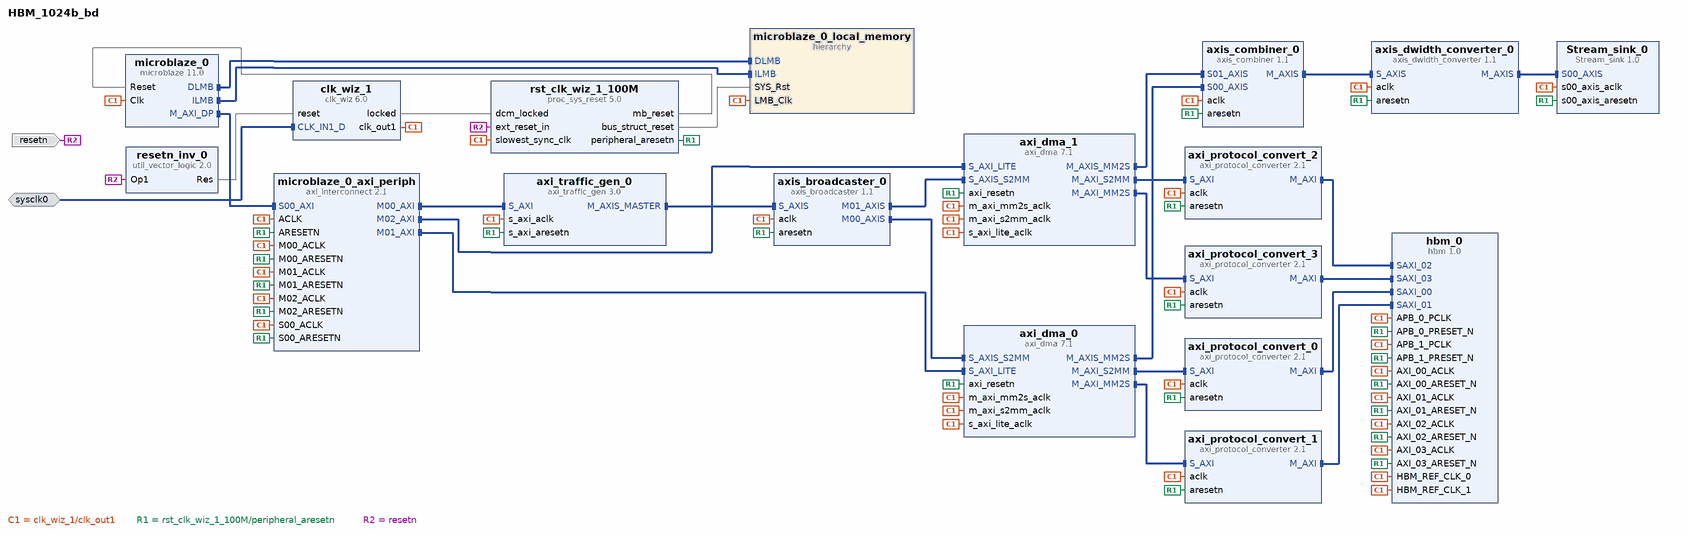
[diagram p0: block diagram of the top level]
# Vivado block design HBM_1024b_bd, xcu280-fsvh2892-2L-e, Vivado 2020.1
create_bd_design HBM_1024b_bd

create_bd_intf_port -mode Slave -vlnv xilinx.com:interface:diff_clock_rtl:1.0 sysclk0
set_property -dict {CONFIG.FREQ_HZ 100000000} [get_bd_intf_ports sysclk0]
create_bd_port -dir I -type rst resetn
set_property -dict {CONFIG.POLARITY ACTIVE_LOW} [get_bd_ports resetn]

create_bd_cell -type ip -vlnv xilinx.com:ip:hbm:1.0 hbm_0
set_property -dict [list \
  CONFIG.USER_APB_EN false \
  CONFIG.USER_CLK_SEL_LIST0 AXI_01_ACLK \
  CONFIG.USER_CLK_SEL_LIST1 AXI_16_ACLK \
  CONFIG.USER_HBM_CP_1 6 \
  CONFIG.USER_HBM_DENSITY 8GB \
  CONFIG.USER_HBM_FBDIV_1 36 \
  CONFIG.USER_HBM_HEX_CP_RES_1 0x0000A600 \
  CONFIG.USER_HBM_HEX_FBDIV_CLKOUTDIV_1 0x00000902 \
  CONFIG.USER_HBM_HEX_LOCK_FB_REF_DLY_1 0x00001f1f \
  CONFIG.USER_HBM_LOCK_FB_DLY_1 31 \
  CONFIG.USER_HBM_LOCK_REF_DLY_1 31 \
  CONFIG.USER_HBM_RES_1 10 \
  CONFIG.USER_HBM_STACK 2 \
  CONFIG.USER_MC_ENABLE_08 TRUE \
  CONFIG.USER_MC_ENABLE_09 TRUE \
  CONFIG.USER_MC_ENABLE_10 TRUE \
  CONFIG.USER_MC_ENABLE_11 TRUE \
  CONFIG.USER_MC_ENABLE_12 TRUE \
  CONFIG.USER_MC_ENABLE_13 TRUE \
  CONFIG.USER_MC_ENABLE_14 TRUE \
  CONFIG.USER_MC_ENABLE_15 TRUE \
  CONFIG.USER_MC_ENABLE_APB_01 TRUE \
  CONFIG.USER_PHY_ENABLE_08 TRUE \
  CONFIG.USER_PHY_ENABLE_09 TRUE \
  CONFIG.USER_PHY_ENABLE_10 TRUE \
  CONFIG.USER_PHY_ENABLE_11 TRUE \
  CONFIG.USER_PHY_ENABLE_12 TRUE \
  CONFIG.USER_PHY_ENABLE_13 TRUE \
  CONFIG.USER_PHY_ENABLE_14 TRUE \
  CONFIG.USER_PHY_ENABLE_15 TRUE \
  CONFIG.USER_SAXI_00 true \
  CONFIG.USER_SAXI_01 true \
  CONFIG.USER_SAXI_02 true \
  CONFIG.USER_SAXI_03 true \
  CONFIG.USER_SAXI_04 false \
  CONFIG.USER_SAXI_05 false \
  CONFIG.USER_SAXI_06 false \
  CONFIG.USER_SAXI_07 false \
  CONFIG.USER_SAXI_08 false \
  CONFIG.USER_SAXI_09 false \
  CONFIG.USER_SAXI_10 false \
  CONFIG.USER_SAXI_11 false \
  CONFIG.USER_SAXI_12 false \
  CONFIG.USER_SAXI_13 false \
  CONFIG.USER_SAXI_14 false \
  CONFIG.USER_SAXI_15 false \
  CONFIG.USER_SAXI_16 false \
  CONFIG.USER_SAXI_17 false \
  CONFIG.USER_SAXI_18 false \
  CONFIG.USER_SAXI_19 false \
  CONFIG.USER_SAXI_20 false \
  CONFIG.USER_SAXI_21 false \
  CONFIG.USER_SAXI_22 false \
  CONFIG.USER_SAXI_23 false \
  CONFIG.USER_SAXI_24 false \
  CONFIG.USER_SAXI_25 false \
  CONFIG.USER_SAXI_26 false \
  CONFIG.USER_SAXI_27 false \
  CONFIG.USER_SAXI_28 false \
  CONFIG.USER_SAXI_29 false \
  CONFIG.USER_SAXI_30 false \
  CONFIG.USER_SAXI_31 false \
  CONFIG.USER_SWITCH_ENABLE_00 TRUE \
  CONFIG.USER_SWITCH_ENABLE_01 TRUE \
] [get_bd_cells hbm_0]
create_bd_cell -type ip -vlnv xilinx.com:ip:microblaze:11.0 microblaze_0
set_property -dict [list \
  CONFIG.C_ADDR_TAG_BITS 0 \
  CONFIG.C_DATA_SIZE 64 \
  CONFIG.C_DCACHE_ADDR_TAG 0 \
  CONFIG.C_DEBUG_ENABLED 0 \
  CONFIG.C_D_AXI 1 \
  CONFIG.C_D_LMB 1 \
  CONFIG.C_I_LMB 1 \
  CONFIG.C_TRACE 1 \
] [get_bd_cells microblaze_0]
create_bd_cell -type ip -vlnv xilinx.com:ip:axi_traffic_gen:3.0 axi_traffic_gen_0
set_property -dict [list \
  CONFIG.C_ATG_MODE AXI4-Stream \
  CONFIG.C_AXIS_TDATA_WIDTH 512 \
  CONFIG.C_AXIS_TDEST_WIDTH 0 \
  CONFIG.C_AXIS_TID_WIDTH 0 \
  CONFIG.C_AXIS_TUSER_WIDTH 0 \
] [get_bd_cells axi_traffic_gen_0]
create_bd_cell -type ip -vlnv xilinx.com:ip:axi_dma:7.1 axi_dma_0
set_property -dict [list \
  CONFIG.c_addr_width 33 \
  CONFIG.c_include_mm2s 1 \
  CONFIG.c_include_sg 0 \
  CONFIG.c_m_axi_mm2s_data_width 256 \
  CONFIG.c_m_axis_mm2s_tdata_width 32 \
  CONFIG.c_mm2s_burst_size 16 \
  CONFIG.c_sg_length_width 23 \
] [get_bd_cells axi_dma_0]
create_bd_cell -type ip -vlnv xilinx.com:ip:axis_broadcaster:1.1 axis_broadcaster_0
set_property -dict [list \
  CONFIG.M00_TDATA_REMAP {tdata[255:0]} \
  CONFIG.M01_TDATA_REMAP {tdata[255:0]} \
  CONFIG.M02_TDATA_REMAP {tdata[255:0]} \
  CONFIG.M03_TDATA_REMAP {tdata[255:0]} \
  CONFIG.M_TDATA_NUM_BYTES 32 \
  CONFIG.NUM_MI 2 \
  CONFIG.S_TDATA_NUM_BYTES 64 \
] [get_bd_cells axis_broadcaster_0]
create_bd_cell -type ip -vlnv xilinx.com:ip:axi_dma:7.1 axi_dma_1
set_property -dict [list \
  CONFIG.c_addr_width 33 \
  CONFIG.c_include_mm2s 1 \
  CONFIG.c_include_sg 0 \
  CONFIG.c_m_axi_mm2s_data_width 256 \
  CONFIG.c_m_axis_mm2s_tdata_width 32 \
  CONFIG.c_mm2s_burst_size 16 \
  CONFIG.c_sg_length_width 23 \
] [get_bd_cells axi_dma_1]
create_bd_cell -type hier microblaze_0_local_memory
create_bd_cell -type ip -vlnv xilinx.com:ip:clk_wiz:6.0 clk_wiz_1
set_property -dict [list \
  CONFIG.CLK_IN1_BOARD_INTERFACE sysclk0 \
  CONFIG.PRIM_SOURCE Differential_clock_capable_pin \
  CONFIG.RESET_BOARD_INTERFACE resetn \
  CONFIG.USE_BOARD_FLOW true \
] [get_bd_cells clk_wiz_1]
create_bd_cell -type ip -vlnv xilinx.com:ip:proc_sys_reset:5.0 rst_clk_wiz_1_100M
set_property -dict {CONFIG.RESET_BOARD_INTERFACE resetn CONFIG.USE_BOARD_FLOW true} [get_bd_cells rst_clk_wiz_1_100M]
create_bd_cell -type ip -vlnv xilinx.com:ip:axi_protocol_converter:2.1 axi_protocol_convert_0
set_property -dict {CONFIG.TRANSLATION_MODE 2} [get_bd_cells axi_protocol_convert_0]
create_bd_cell -type ip -vlnv xilinx.com:ip:axi_protocol_converter:2.1 axi_protocol_convert_1
set_property -dict {CONFIG.TRANSLATION_MODE 2} [get_bd_cells axi_protocol_convert_1]
create_bd_cell -type ip -vlnv xilinx.com:ip:axi_protocol_converter:2.1 axi_protocol_convert_2
set_property -dict {CONFIG.TRANSLATION_MODE 2} [get_bd_cells axi_protocol_convert_2]
create_bd_cell -type ip -vlnv xilinx.com:ip:axi_protocol_converter:2.1 axi_protocol_convert_3
set_property -dict {CONFIG.TRANSLATION_MODE 2} [get_bd_cells axi_protocol_convert_3]
create_bd_cell -type ip -vlnv xilinx.com:ip:axi_interconnect:2.1 microblaze_0_axi_periph
set_property -dict {CONFIG.NUM_MI 3} [get_bd_cells microblaze_0_axi_periph]
create_bd_cell -type ip -vlnv xilinx.com:ip:util_vector_logic:2.0 resetn_inv_0
set_property -dict {CONFIG.C_OPERATION not CONFIG.C_SIZE 1} [get_bd_cells resetn_inv_0]
create_bd_cell -type ip -vlnv xilinx.com:ip:axis_combiner:1.1 axis_combiner_0
create_bd_cell -type ip -vlnv user.org:user:Stream_sink:1.0 Stream_sink_0
create_bd_cell -type ip -vlnv xilinx.com:ip:axis_dwidth_converter:1.1 axis_dwidth_converter_0
set_property -dict {CONFIG.M_TDATA_NUM_BYTES 32} [get_bd_cells axis_dwidth_converter_0]

# ---- hierarchy /microblaze_0_local_memory ----
current_bd_instance /microblaze_0_local_memory
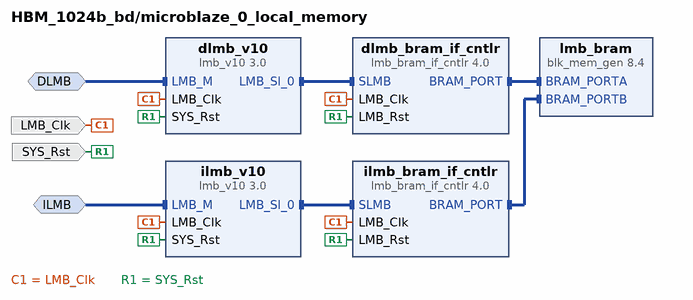
[diagram p1: block diagram inside /microblaze_0_local_memory]
create_bd_intf_pin -mode MirroredMaster -vlnv xilinx.com:interface:lmb_rtl:1.0 DLMB
create_bd_intf_pin -mode MirroredMaster -vlnv xilinx.com:interface:lmb_rtl:1.0 ILMB
create_bd_pin -dir I -type clk LMB_Clk
create_bd_pin -dir I -type rst SYS_Rst

create_bd_cell -type ip -vlnv xilinx.com:ip:lmb_v10:3.0 dlmb_v10
create_bd_cell -type ip -vlnv xilinx.com:ip:lmb_v10:3.0 ilmb_v10
create_bd_cell -type ip -vlnv xilinx.com:ip:lmb_bram_if_cntlr:4.0 dlmb_bram_if_cntlr
set_property -dict {CONFIG.C_ECC 0} [get_bd_cells dlmb_bram_if_cntlr]
create_bd_cell -type ip -vlnv xilinx.com:ip:lmb_bram_if_cntlr:4.0 ilmb_bram_if_cntlr
set_property -dict {CONFIG.C_ECC 0} [get_bd_cells ilmb_bram_if_cntlr]
create_bd_cell -type ip -vlnv xilinx.com:ip:blk_mem_gen:8.4 lmb_bram
set_property -dict {CONFIG.Memory_Type True_Dual_Port_RAM CONFIG.use_bram_block BRAM_Controller} [get_bd_cells lmb_bram]

# ---- connections ----

current_bd_instance /microblaze_0_local_memory
connect_bd_intf_net -intf_net microblaze_0_dlmb_bus [get_bd_intf_pins dlmb_v10/LMB_Sl_0] [get_bd_intf_pins dlmb_bram_if_cntlr/SLMB]
connect_bd_intf_net -intf_net microblaze_0_ilmb_bus [get_bd_intf_pins ilmb_v10/LMB_Sl_0] [get_bd_intf_pins ilmb_bram_if_cntlr/SLMB]
connect_bd_intf_net -intf_net microblaze_0_dlmb_cntlr [get_bd_intf_pins dlmb_bram_if_cntlr/BRAM_PORT] [get_bd_intf_pins lmb_bram/BRAM_PORTA]
connect_bd_intf_net -intf_net microblaze_0_ilmb_cntlr [get_bd_intf_pins ilmb_bram_if_cntlr/BRAM_PORT] [get_bd_intf_pins lmb_bram/BRAM_PORTB]
connect_bd_intf_net -intf_net microblaze_0_dlmb [get_bd_intf_pins DLMB] [get_bd_intf_pins dlmb_v10/LMB_M]
connect_bd_intf_net -intf_net microblaze_0_ilmb [get_bd_intf_pins ILMB] [get_bd_intf_pins ilmb_v10/LMB_M]
connect_bd_net -net microblaze_0_Clk [get_bd_pins LMB_Clk] \
  [get_bd_pins dlmb_v10/LMB_Clk] [get_bd_pins dlmb_bram_if_cntlr/LMB_Clk] [get_bd_pins ilmb_v10/LMB_Clk] \
  [get_bd_pins ilmb_bram_if_cntlr/LMB_Clk]
connect_bd_net [get_bd_pins SYS_Rst] \
  [get_bd_pins dlmb_v10/SYS_Rst] [get_bd_pins dlmb_bram_if_cntlr/LMB_Rst] [get_bd_pins ilmb_v10/SYS_Rst] \
  [get_bd_pins ilmb_bram_if_cntlr/LMB_Rst]
set_property HDL_ATTRIBUTE.BMM_INFO_ADDRESS_SPACE {byte  0x00000000 32 > HBM_1024b_bd microblaze_0_local_memory/lmb_bram} [get_bd_cells dlmb_bram_if_cntlr]
set_property HDL_ATTRIBUTE.KEEP_HIERARCHY yes [get_bd_cells dlmb_bram_if_cntlr]
set_property HDL_ATTRIBUTE.BMM_INFO_ADDRESS_SPACE {byte  0x00000000 32 > HBM_1024b_bd microblaze_0_local_memory/lmb_bram} [get_bd_cells ilmb_bram_if_cntlr]
set_property HDL_ATTRIBUTE.KEEP_HIERARCHY yes [get_bd_cells ilmb_bram_if_cntlr]

current_bd_instance /
connect_bd_intf_net [get_bd_intf_pins microblaze_0/M_AXI_DP] [get_bd_intf_pins microblaze_0_axi_periph/S00_AXI]
connect_bd_intf_net [get_bd_intf_pins microblaze_0/DLMB] [get_bd_intf_pins microblaze_0_local_memory/DLMB]
connect_bd_intf_net [get_bd_intf_pins axis_broadcaster_0/M00_AXIS] [get_bd_intf_pins axi_dma_0/S_AXIS_S2MM]
connect_bd_intf_net [get_bd_intf_pins axi_traffic_gen_0/M_AXIS_MASTER] [get_bd_intf_pins axis_broadcaster_0/S_AXIS]
connect_bd_intf_net [get_bd_intf_pins axis_dwidth_converter_0/M_AXIS] [get_bd_intf_pins Stream_sink_0/S00_AXIS]
connect_bd_intf_net [get_bd_intf_pins axis_broadcaster_0/M01_AXIS] [get_bd_intf_pins axi_dma_1/S_AXIS_S2MM]
connect_bd_intf_net [get_bd_intf_pins microblaze_0/ILMB] [get_bd_intf_pins microblaze_0_local_memory/ILMB]
connect_bd_intf_net [get_bd_intf_pins axi_dma_0/M_AXI_MM2S] [get_bd_intf_pins axi_protocol_convert_1/S_AXI]
connect_bd_intf_net [get_bd_intf_pins axi_dma_0/M_AXI_S2MM] [get_bd_intf_pins axi_protocol_convert_0/S_AXI]
connect_bd_intf_net [get_bd_intf_pins axis_combiner_0/M_AXIS] [get_bd_intf_pins axis_dwidth_converter_0/S_AXIS]
connect_bd_intf_net -intf_net sysclk0_1 [get_bd_intf_ports sysclk0] [get_bd_intf_pins clk_wiz_1/CLK_IN1_D]
connect_bd_intf_net [get_bd_intf_pins axi_protocol_convert_2/M_AXI] [get_bd_intf_pins hbm_0/SAXI_02]
connect_bd_intf_net [get_bd_intf_pins microblaze_0_axi_periph/M01_AXI] [get_bd_intf_pins axi_dma_0/S_AXI_LITE]
connect_bd_intf_net [get_bd_intf_pins microblaze_0_axi_periph/M00_AXI] [get_bd_intf_pins axi_traffic_gen_0/S_AXI]
connect_bd_intf_net [get_bd_intf_pins microblaze_0_axi_periph/M02_AXI] [get_bd_intf_pins axi_dma_1/S_AXI_LITE]
connect_bd_intf_net [get_bd_intf_pins axi_protocol_convert_0/M_AXI] [get_bd_intf_pins hbm_0/SAXI_00]
connect_bd_intf_net [get_bd_intf_pins axi_protocol_convert_3/M_AXI] [get_bd_intf_pins hbm_0/SAXI_03]
connect_bd_intf_net [get_bd_intf_pins axi_dma_1/M_AXIS_MM2S] [get_bd_intf_pins axis_combiner_0/S01_AXIS]
connect_bd_intf_net [get_bd_intf_pins axi_dma_1/M_AXI_MM2S] [get_bd_intf_pins axi_protocol_convert_3/S_AXI]
connect_bd_intf_net [get_bd_intf_pins axi_dma_0/M_AXIS_MM2S] [get_bd_intf_pins axis_combiner_0/S00_AXIS]
connect_bd_intf_net [get_bd_intf_pins axi_dma_1/M_AXI_S2MM] [get_bd_intf_pins axi_protocol_convert_2/S_AXI]
connect_bd_intf_net [get_bd_intf_pins axi_protocol_convert_1/M_AXI] [get_bd_intf_pins hbm_0/SAXI_01]
connect_bd_net -net microblaze_0_Clk [get_bd_pins clk_wiz_1/clk_out1] \
  [get_bd_pins microblaze_0/Clk] [get_bd_pins microblaze_0_local_memory/LMB_Clk] \
  [get_bd_pins rst_clk_wiz_1_100M/slowest_sync_clk] [get_bd_pins axi_dma_0/m_axi_s2mm_aclk] \
  [get_bd_pins axi_protocol_convert_0/aclk] [get_bd_pins axis_broadcaster_0/aclk] \
  [get_bd_pins microblaze_0_axi_periph/S00_ACLK] [get_bd_pins axi_dma_0/s_axi_lite_aclk] \
  [get_bd_pins microblaze_0_axi_periph/M00_ACLK] [get_bd_pins microblaze_0_axi_periph/ACLK] \
  [get_bd_pins axi_dma_1/m_axi_s2mm_aclk] [get_bd_pins axi_protocol_convert_1/aclk] [get_bd_pins axi_dma_1/s_axi_lite_aclk] \
  [get_bd_pins microblaze_0_axi_periph/M01_ACLK] [get_bd_pins axi_protocol_convert_2/aclk] \
  [get_bd_pins microblaze_0_axi_periph/M02_ACLK] [get_bd_pins axi_protocol_convert_3/aclk] \
  [get_bd_pins axi_traffic_gen_0/s_axi_aclk] [get_bd_pins hbm_0/HBM_REF_CLK_0] [get_bd_pins hbm_0/APB_0_PCLK] \
  [get_bd_pins hbm_0/HBM_REF_CLK_1] [get_bd_pins hbm_0/APB_1_PCLK] [get_bd_pins hbm_0/AXI_00_ACLK] \
  [get_bd_pins axi_dma_0/m_axi_mm2s_aclk] [get_bd_pins axis_combiner_0/aclk] [get_bd_pins axi_dma_1/m_axi_mm2s_aclk] \
  [get_bd_pins Stream_sink_0/s00_axis_aclk] [get_bd_pins hbm_0/AXI_01_ACLK] [get_bd_pins hbm_0/AXI_02_ACLK] \
  [get_bd_pins hbm_0/AXI_03_ACLK] [get_bd_pins axis_dwidth_converter_0/aclk]
connect_bd_net [get_bd_pins clk_wiz_1/locked] [get_bd_pins rst_clk_wiz_1_100M/dcm_locked]
connect_bd_net [get_bd_pins rst_clk_wiz_1_100M/mb_reset] [get_bd_pins microblaze_0/Reset]
connect_bd_net [get_bd_pins rst_clk_wiz_1_100M/bus_struct_reset] [get_bd_pins microblaze_0_local_memory/SYS_Rst]
connect_bd_net [get_bd_pins rst_clk_wiz_1_100M/peripheral_aresetn] \
  [get_bd_pins axi_protocol_convert_0/aresetn] [get_bd_pins axis_broadcaster_0/aresetn] \
  [get_bd_pins microblaze_0_axi_periph/S00_ARESETN] [get_bd_pins axi_dma_0/axi_resetn] \
  [get_bd_pins microblaze_0_axi_periph/M00_ARESETN] [get_bd_pins microblaze_0_axi_periph/ARESETN] \
  [get_bd_pins axi_protocol_convert_1/aresetn] [get_bd_pins axi_dma_1/axi_resetn] \
  [get_bd_pins microblaze_0_axi_periph/M01_ARESETN] [get_bd_pins axi_protocol_convert_2/aresetn] \
  [get_bd_pins microblaze_0_axi_periph/M02_ARESETN] [get_bd_pins axi_protocol_convert_3/aresetn] \
  [get_bd_pins axi_traffic_gen_0/s_axi_aresetn] [get_bd_pins hbm_0/APB_1_PRESET_N] [get_bd_pins hbm_0/APB_0_PRESET_N] \
  [get_bd_pins hbm_0/AXI_00_ARESET_N] [get_bd_pins axis_combiner_0/aresetn] [get_bd_pins Stream_sink_0/s00_axis_aresetn] \
  [get_bd_pins hbm_0/AXI_01_ARESET_N] [get_bd_pins hbm_0/AXI_02_ARESET_N] [get_bd_pins hbm_0/AXI_03_ARESET_N] \
  [get_bd_pins axis_dwidth_converter_0/aresetn]
connect_bd_net [get_bd_ports resetn] [get_bd_pins resetn_inv_0/Op1] [get_bd_pins rst_clk_wiz_1_100M/ext_reset_in]
connect_bd_net [get_bd_pins resetn_inv_0/Res] [get_bd_pins clk_wiz_1/reset]
set_property HDL_ATTRIBUTE.BMM_INFO_PROCESSOR {microblaze-le > HBM_1024b_bd microblaze_0_local_memory/dlmb_bram_if_cntlr} [get_bd_cells microblaze_0]
set_property HDL_ATTRIBUTE.KEEP_HIERARCHY yes [get_bd_cells microblaze_0]

# ---- address map ----
assign_bd_address -offset 0x008000000 -range 128M -target_address_space [get_bd_addr_spaces axi_dma_0/Data_MM2S] [get_bd_addr_segs hbm_0/SAXI_01/HBM_MEM00]
assign_bd_address -offset 0x010000000 -range 256M -target_address_space [get_bd_addr_spaces axi_dma_0/Data_MM2S] [get_bd_addr_segs hbm_0/SAXI_01/HBM_MEM01]
assign_bd_address -offset 0x020000000 -range 256M -target_address_space [get_bd_addr_spaces axi_dma_0/Data_MM2S] [get_bd_addr_segs hbm_0/SAXI_01/HBM_MEM02]
assign_bd_address -offset 0x030000000 -range 256M -target_address_space [get_bd_addr_spaces axi_dma_0/Data_MM2S] [get_bd_addr_segs hbm_0/SAXI_01/HBM_MEM03]
assign_bd_address -offset 0x040000000 -range 256M -target_address_space [get_bd_addr_spaces axi_dma_0/Data_MM2S] [get_bd_addr_segs hbm_0/SAXI_01/HBM_MEM04]
assign_bd_address -offset 0x050000000 -range 256M -target_address_space [get_bd_addr_spaces axi_dma_0/Data_MM2S] [get_bd_addr_segs hbm_0/SAXI_01/HBM_MEM05]
assign_bd_address -offset 0x060000000 -range 256M -target_address_space [get_bd_addr_spaces axi_dma_0/Data_MM2S] [get_bd_addr_segs hbm_0/SAXI_01/HBM_MEM06]
assign_bd_address -offset 0x070000000 -range 256M -target_address_space [get_bd_addr_spaces axi_dma_0/Data_MM2S] [get_bd_addr_segs hbm_0/SAXI_01/HBM_MEM07]
assign_bd_address -offset 0x080000000 -range 256M -target_address_space [get_bd_addr_spaces axi_dma_0/Data_MM2S] [get_bd_addr_segs hbm_0/SAXI_01/HBM_MEM08]
assign_bd_address -offset 0x090000000 -range 256M -target_address_space [get_bd_addr_spaces axi_dma_0/Data_MM2S] [get_bd_addr_segs hbm_0/SAXI_01/HBM_MEM09]
assign_bd_address -offset 0x0A0000000 -range 256M -target_address_space [get_bd_addr_spaces axi_dma_0/Data_MM2S] [get_bd_addr_segs hbm_0/SAXI_01/HBM_MEM10]
assign_bd_address -offset 0x0B0000000 -range 256M -target_address_space [get_bd_addr_spaces axi_dma_0/Data_MM2S] [get_bd_addr_segs hbm_0/SAXI_01/HBM_MEM11]
assign_bd_address -offset 0x0C0000000 -range 256M -target_address_space [get_bd_addr_spaces axi_dma_0/Data_MM2S] [get_bd_addr_segs hbm_0/SAXI_01/HBM_MEM12]
assign_bd_address -offset 0x0D0000000 -range 256M -target_address_space [get_bd_addr_spaces axi_dma_0/Data_MM2S] [get_bd_addr_segs hbm_0/SAXI_01/HBM_MEM13]
assign_bd_address -offset 0x0E0000000 -range 256M -target_address_space [get_bd_addr_spaces axi_dma_0/Data_MM2S] [get_bd_addr_segs hbm_0/SAXI_01/HBM_MEM14]
assign_bd_address -offset 0x0F0000000 -range 256M -target_address_space [get_bd_addr_spaces axi_dma_0/Data_MM2S] [get_bd_addr_segs hbm_0/SAXI_01/HBM_MEM15]
assign_bd_address -offset 0x100000000 -range 256M -target_address_space [get_bd_addr_spaces axi_dma_0/Data_MM2S] [get_bd_addr_segs hbm_0/SAXI_01/HBM_MEM16]
assign_bd_address -offset 0x110000000 -range 256M -target_address_space [get_bd_addr_spaces axi_dma_0/Data_MM2S] [get_bd_addr_segs hbm_0/SAXI_01/HBM_MEM17]
assign_bd_address -offset 0x120000000 -range 256M -target_address_space [get_bd_addr_spaces axi_dma_0/Data_MM2S] [get_bd_addr_segs hbm_0/SAXI_01/HBM_MEM18]
assign_bd_address -offset 0x130000000 -range 256M -target_address_space [get_bd_addr_spaces axi_dma_0/Data_MM2S] [get_bd_addr_segs hbm_0/SAXI_01/HBM_MEM19]
assign_bd_address -offset 0x140000000 -range 256M -target_address_space [get_bd_addr_spaces axi_dma_0/Data_MM2S] [get_bd_addr_segs hbm_0/SAXI_01/HBM_MEM20]
assign_bd_address -offset 0x150000000 -range 256M -target_address_space [get_bd_addr_spaces axi_dma_0/Data_MM2S] [get_bd_addr_segs hbm_0/SAXI_01/HBM_MEM21]
assign_bd_address -offset 0x160000000 -range 256M -target_address_space [get_bd_addr_spaces axi_dma_0/Data_MM2S] [get_bd_addr_segs hbm_0/SAXI_01/HBM_MEM22]
assign_bd_address -offset 0x170000000 -range 256M -target_address_space [get_bd_addr_spaces axi_dma_0/Data_MM2S] [get_bd_addr_segs hbm_0/SAXI_01/HBM_MEM23]
assign_bd_address -offset 0x180000000 -range 256M -target_address_space [get_bd_addr_spaces axi_dma_0/Data_MM2S] [get_bd_addr_segs hbm_0/SAXI_01/HBM_MEM24]
assign_bd_address -offset 0x190000000 -range 256M -target_address_space [get_bd_addr_spaces axi_dma_0/Data_MM2S] [get_bd_addr_segs hbm_0/SAXI_01/HBM_MEM25]
assign_bd_address -offset 0x1A0000000 -range 256M -target_address_space [get_bd_addr_spaces axi_dma_0/Data_MM2S] [get_bd_addr_segs hbm_0/SAXI_01/HBM_MEM26]
assign_bd_address -offset 0x1B0000000 -range 256M -target_address_space [get_bd_addr_spaces axi_dma_0/Data_MM2S] [get_bd_addr_segs hbm_0/SAXI_01/HBM_MEM27]
assign_bd_address -offset 0x1C0000000 -range 256M -target_address_space [get_bd_addr_spaces axi_dma_0/Data_MM2S] [get_bd_addr_segs hbm_0/SAXI_01/HBM_MEM28]
assign_bd_address -offset 0x1D0000000 -range 256M -target_address_space [get_bd_addr_spaces axi_dma_0/Data_MM2S] [get_bd_addr_segs hbm_0/SAXI_01/HBM_MEM29]
assign_bd_address -offset 0x1E0000000 -range 256M -target_address_space [get_bd_addr_spaces axi_dma_0/Data_MM2S] [get_bd_addr_segs hbm_0/SAXI_01/HBM_MEM30]
assign_bd_address -offset 0x1F0000000 -range 256M -target_address_space [get_bd_addr_spaces axi_dma_0/Data_MM2S] [get_bd_addr_segs hbm_0/SAXI_01/HBM_MEM31]
assign_bd_address -offset 0x008000000 -range 128M -target_address_space [get_bd_addr_spaces axi_dma_0/Data_S2MM] [get_bd_addr_segs hbm_0/SAXI_00/HBM_MEM00]
assign_bd_address -offset 0x010000000 -range 256M -target_address_space [get_bd_addr_spaces axi_dma_0/Data_S2MM] [get_bd_addr_segs hbm_0/SAXI_00/HBM_MEM01]
assign_bd_address -offset 0x020000000 -range 256M -target_address_space [get_bd_addr_spaces axi_dma_0/Data_S2MM] [get_bd_addr_segs hbm_0/SAXI_00/HBM_MEM02]
assign_bd_address -offset 0x030000000 -range 256M -target_address_space [get_bd_addr_spaces axi_dma_0/Data_S2MM] [get_bd_addr_segs hbm_0/SAXI_00/HBM_MEM03]
assign_bd_address -offset 0x040000000 -range 256M -target_address_space [get_bd_addr_spaces axi_dma_0/Data_S2MM] [get_bd_addr_segs hbm_0/SAXI_00/HBM_MEM04]
assign_bd_address -offset 0x050000000 -range 256M -target_address_space [get_bd_addr_spaces axi_dma_0/Data_S2MM] [get_bd_addr_segs hbm_0/SAXI_00/HBM_MEM05]
assign_bd_address -offset 0x060000000 -range 256M -target_address_space [get_bd_addr_spaces axi_dma_0/Data_S2MM] [get_bd_addr_segs hbm_0/SAXI_00/HBM_MEM06]
assign_bd_address -offset 0x070000000 -range 256M -target_address_space [get_bd_addr_spaces axi_dma_0/Data_S2MM] [get_bd_addr_segs hbm_0/SAXI_00/HBM_MEM07]
assign_bd_address -offset 0x080000000 -range 256M -target_address_space [get_bd_addr_spaces axi_dma_0/Data_S2MM] [get_bd_addr_segs hbm_0/SAXI_00/HBM_MEM08]
assign_bd_address -offset 0x090000000 -range 256M -target_address_space [get_bd_addr_spaces axi_dma_0/Data_S2MM] [get_bd_addr_segs hbm_0/SAXI_00/HBM_MEM09]
assign_bd_address -offset 0x0A0000000 -range 256M -target_address_space [get_bd_addr_spaces axi_dma_0/Data_S2MM] [get_bd_addr_segs hbm_0/SAXI_00/HBM_MEM10]
assign_bd_address -offset 0x0B0000000 -range 256M -target_address_space [get_bd_addr_spaces axi_dma_0/Data_S2MM] [get_bd_addr_segs hbm_0/SAXI_00/HBM_MEM11]
assign_bd_address -offset 0x0C0000000 -range 256M -target_address_space [get_bd_addr_spaces axi_dma_0/Data_S2MM] [get_bd_addr_segs hbm_0/SAXI_00/HBM_MEM12]
assign_bd_address -offset 0x0D0000000 -range 256M -target_address_space [get_bd_addr_spaces axi_dma_0/Data_S2MM] [get_bd_addr_segs hbm_0/SAXI_00/HBM_MEM13]
assign_bd_address -offset 0x0E0000000 -range 256M -target_address_space [get_bd_addr_spaces axi_dma_0/Data_S2MM] [get_bd_addr_segs hbm_0/SAXI_00/HBM_MEM14]
assign_bd_address -offset 0x0F0000000 -range 256M -target_address_space [get_bd_addr_spaces axi_dma_0/Data_S2MM] [get_bd_addr_segs hbm_0/SAXI_00/HBM_MEM15]
assign_bd_address -offset 0x100000000 -range 256M -target_address_space [get_bd_addr_spaces axi_dma_0/Data_S2MM] [get_bd_addr_segs hbm_0/SAXI_00/HBM_MEM16]
assign_bd_address -offset 0x110000000 -range 256M -target_address_space [get_bd_addr_spaces axi_dma_0/Data_S2MM] [get_bd_addr_segs hbm_0/SAXI_00/HBM_MEM17]
assign_bd_address -offset 0x120000000 -range 256M -target_address_space [get_bd_addr_spaces axi_dma_0/Data_S2MM] [get_bd_addr_segs hbm_0/SAXI_00/HBM_MEM18]
assign_bd_address -offset 0x130000000 -range 256M -target_address_space [get_bd_addr_spaces axi_dma_0/Data_S2MM] [get_bd_addr_segs hbm_0/SAXI_00/HBM_MEM19]
assign_bd_address -offset 0x140000000 -range 256M -target_address_space [get_bd_addr_spaces axi_dma_0/Data_S2MM] [get_bd_addr_segs hbm_0/SAXI_00/HBM_MEM20]
assign_bd_address -offset 0x150000000 -range 256M -target_address_space [get_bd_addr_spaces axi_dma_0/Data_S2MM] [get_bd_addr_segs hbm_0/SAXI_00/HBM_MEM21]
assign_bd_address -offset 0x160000000 -range 256M -target_address_space [get_bd_addr_spaces axi_dma_0/Data_S2MM] [get_bd_addr_segs hbm_0/SAXI_00/HBM_MEM22]
assign_bd_address -offset 0x170000000 -range 256M -target_address_space [get_bd_addr_spaces axi_dma_0/Data_S2MM] [get_bd_addr_segs hbm_0/SAXI_00/HBM_MEM23]
assign_bd_address -offset 0x180000000 -range 256M -target_address_space [get_bd_addr_spaces axi_dma_0/Data_S2MM] [get_bd_addr_segs hbm_0/SAXI_00/HBM_MEM24]
assign_bd_address -offset 0x190000000 -range 256M -target_address_space [get_bd_addr_spaces axi_dma_0/Data_S2MM] [get_bd_addr_segs hbm_0/SAXI_00/HBM_MEM25]
assign_bd_address -offset 0x1A0000000 -range 256M -target_address_space [get_bd_addr_spaces axi_dma_0/Data_S2MM] [get_bd_addr_segs hbm_0/SAXI_00/HBM_MEM26]
assign_bd_address -offset 0x1B0000000 -range 256M -target_address_space [get_bd_addr_spaces axi_dma_0/Data_S2MM] [get_bd_addr_segs hbm_0/SAXI_00/HBM_MEM27]
assign_bd_address -offset 0x1C0000000 -range 256M -target_address_space [get_bd_addr_spaces axi_dma_0/Data_S2MM] [get_bd_addr_segs hbm_0/SAXI_00/HBM_MEM28]
assign_bd_address -offset 0x1D0000000 -range 256M -target_address_space [get_bd_addr_spaces axi_dma_0/Data_S2MM] [get_bd_addr_segs hbm_0/SAXI_00/HBM_MEM29]
assign_bd_address -offset 0x1E0000000 -range 256M -target_address_space [get_bd_addr_spaces axi_dma_0/Data_S2MM] [get_bd_addr_segs hbm_0/SAXI_00/HBM_MEM30]
assign_bd_address -offset 0x1F0000000 -range 256M -target_address_space [get_bd_addr_spaces axi_dma_0/Data_S2MM] [get_bd_addr_segs hbm_0/SAXI_00/HBM_MEM31]
assign_bd_address -offset 0x008000000 -range 128M -target_address_space [get_bd_addr_spaces axi_dma_1/Data_MM2S] [get_bd_addr_segs hbm_0/SAXI_03/HBM_MEM00]
assign_bd_address -offset 0x010000000 -range 256M -target_address_space [get_bd_addr_spaces axi_dma_1/Data_MM2S] [get_bd_addr_segs hbm_0/SAXI_03/HBM_MEM01]
assign_bd_address -offset 0x020000000 -range 256M -target_address_space [get_bd_addr_spaces axi_dma_1/Data_MM2S] [get_bd_addr_segs hbm_0/SAXI_03/HBM_MEM02]
assign_bd_address -offset 0x030000000 -range 256M -target_address_space [get_bd_addr_spaces axi_dma_1/Data_MM2S] [get_bd_addr_segs hbm_0/SAXI_03/HBM_MEM03]
assign_bd_address -offset 0x040000000 -range 256M -target_address_space [get_bd_addr_spaces axi_dma_1/Data_MM2S] [get_bd_addr_segs hbm_0/SAXI_03/HBM_MEM04]
assign_bd_address -offset 0x050000000 -range 256M -target_address_space [get_bd_addr_spaces axi_dma_1/Data_MM2S] [get_bd_addr_segs hbm_0/SAXI_03/HBM_MEM05]
assign_bd_address -offset 0x060000000 -range 256M -target_address_space [get_bd_addr_spaces axi_dma_1/Data_MM2S] [get_bd_addr_segs hbm_0/SAXI_03/HBM_MEM06]
assign_bd_address -offset 0x070000000 -range 256M -target_address_space [get_bd_addr_spaces axi_dma_1/Data_MM2S] [get_bd_addr_segs hbm_0/SAXI_03/HBM_MEM07]
assign_bd_address -offset 0x080000000 -range 256M -target_address_space [get_bd_addr_spaces axi_dma_1/Data_MM2S] [get_bd_addr_segs hbm_0/SAXI_03/HBM_MEM08]
assign_bd_address -offset 0x090000000 -range 256M -target_address_space [get_bd_addr_spaces axi_dma_1/Data_MM2S] [get_bd_addr_segs hbm_0/SAXI_03/HBM_MEM09]
assign_bd_address -offset 0x0A0000000 -range 256M -target_address_space [get_bd_addr_spaces axi_dma_1/Data_MM2S] [get_bd_addr_segs hbm_0/SAXI_03/HBM_MEM10]
assign_bd_address -offset 0x0B0000000 -range 256M -target_address_space [get_bd_addr_spaces axi_dma_1/Data_MM2S] [get_bd_addr_segs hbm_0/SAXI_03/HBM_MEM11]
assign_bd_address -offset 0x0C0000000 -range 256M -target_address_space [get_bd_addr_spaces axi_dma_1/Data_MM2S] [get_bd_addr_segs hbm_0/SAXI_03/HBM_MEM12]
assign_bd_address -offset 0x0D0000000 -range 256M -target_address_space [get_bd_addr_spaces axi_dma_1/Data_MM2S] [get_bd_addr_segs hbm_0/SAXI_03/HBM_MEM13]
assign_bd_address -offset 0x0E0000000 -range 256M -target_address_space [get_bd_addr_spaces axi_dma_1/Data_MM2S] [get_bd_addr_segs hbm_0/SAXI_03/HBM_MEM14]
assign_bd_address -offset 0x0F0000000 -range 256M -target_address_space [get_bd_addr_spaces axi_dma_1/Data_MM2S] [get_bd_addr_segs hbm_0/SAXI_03/HBM_MEM15]
assign_bd_address -offset 0x100000000 -range 256M -target_address_space [get_bd_addr_spaces axi_dma_1/Data_MM2S] [get_bd_addr_segs hbm_0/SAXI_03/HBM_MEM16]
assign_bd_address -offset 0x110000000 -range 256M -target_address_space [get_bd_addr_spaces axi_dma_1/Data_MM2S] [get_bd_addr_segs hbm_0/SAXI_03/HBM_MEM17]
assign_bd_address -offset 0x120000000 -range 256M -target_address_space [get_bd_addr_spaces axi_dma_1/Data_MM2S] [get_bd_addr_segs hbm_0/SAXI_03/HBM_MEM18]
assign_bd_address -offset 0x130000000 -range 256M -target_address_space [get_bd_addr_spaces axi_dma_1/Data_MM2S] [get_bd_addr_segs hbm_0/SAXI_03/HBM_MEM19]
assign_bd_address -offset 0x140000000 -range 256M -target_address_space [get_bd_addr_spaces axi_dma_1/Data_MM2S] [get_bd_addr_segs hbm_0/SAXI_03/HBM_MEM20]
assign_bd_address -offset 0x150000000 -range 256M -target_address_space [get_bd_addr_spaces axi_dma_1/Data_MM2S] [get_bd_addr_segs hbm_0/SAXI_03/HBM_MEM21]
assign_bd_address -offset 0x160000000 -range 256M -target_address_space [get_bd_addr_spaces axi_dma_1/Data_MM2S] [get_bd_addr_segs hbm_0/SAXI_03/HBM_MEM22]
assign_bd_address -offset 0x170000000 -range 256M -target_address_space [get_bd_addr_spaces axi_dma_1/Data_MM2S] [get_bd_addr_segs hbm_0/SAXI_03/HBM_MEM23]
assign_bd_address -offset 0x180000000 -range 256M -target_address_space [get_bd_addr_spaces axi_dma_1/Data_MM2S] [get_bd_addr_segs hbm_0/SAXI_03/HBM_MEM24]
assign_bd_address -offset 0x190000000 -range 256M -target_address_space [get_bd_addr_spaces axi_dma_1/Data_MM2S] [get_bd_addr_segs hbm_0/SAXI_03/HBM_MEM25]
assign_bd_address -offset 0x1A0000000 -range 256M -target_address_space [get_bd_addr_spaces axi_dma_1/Data_MM2S] [get_bd_addr_segs hbm_0/SAXI_03/HBM_MEM26]
assign_bd_address -offset 0x1B0000000 -range 256M -target_address_space [get_bd_addr_spaces axi_dma_1/Data_MM2S] [get_bd_addr_segs hbm_0/SAXI_03/HBM_MEM27]
assign_bd_address -offset 0x1C0000000 -range 256M -target_address_space [get_bd_addr_spaces axi_dma_1/Data_MM2S] [get_bd_addr_segs hbm_0/SAXI_03/HBM_MEM28]
assign_bd_address -offset 0x1D0000000 -range 256M -target_address_space [get_bd_addr_spaces axi_dma_1/Data_MM2S] [get_bd_addr_segs hbm_0/SAXI_03/HBM_MEM29]
assign_bd_address -offset 0x1E0000000 -range 256M -target_address_space [get_bd_addr_spaces axi_dma_1/Data_MM2S] [get_bd_addr_segs hbm_0/SAXI_03/HBM_MEM30]
assign_bd_address -offset 0x1F0000000 -range 256M -target_address_space [get_bd_addr_spaces axi_dma_1/Data_MM2S] [get_bd_addr_segs hbm_0/SAXI_03/HBM_MEM31]
assign_bd_address -offset 0x008000000 -range 128M -target_address_space [get_bd_addr_spaces axi_dma_1/Data_S2MM] [get_bd_addr_segs hbm_0/SAXI_02/HBM_MEM00]
assign_bd_address -offset 0x010000000 -range 256M -target_address_space [get_bd_addr_spaces axi_dma_1/Data_S2MM] [get_bd_addr_segs hbm_0/SAXI_02/HBM_MEM01]
assign_bd_address -offset 0x020000000 -range 256M -target_address_space [get_bd_addr_spaces axi_dma_1/Data_S2MM] [get_bd_addr_segs hbm_0/SAXI_02/HBM_MEM02]
assign_bd_address -offset 0x030000000 -range 256M -target_address_space [get_bd_addr_spaces axi_dma_1/Data_S2MM] [get_bd_addr_segs hbm_0/SAXI_02/HBM_MEM03]
assign_bd_address -offset 0x040000000 -range 256M -target_address_space [get_bd_addr_spaces axi_dma_1/Data_S2MM] [get_bd_addr_segs hbm_0/SAXI_02/HBM_MEM04]
assign_bd_address -offset 0x050000000 -range 256M -target_address_space [get_bd_addr_spaces axi_dma_1/Data_S2MM] [get_bd_addr_segs hbm_0/SAXI_02/HBM_MEM05]
assign_bd_address -offset 0x060000000 -range 256M -target_address_space [get_bd_addr_spaces axi_dma_1/Data_S2MM] [get_bd_addr_segs hbm_0/SAXI_02/HBM_MEM06]
assign_bd_address -offset 0x070000000 -range 256M -target_address_space [get_bd_addr_spaces axi_dma_1/Data_S2MM] [get_bd_addr_segs hbm_0/SAXI_02/HBM_MEM07]
assign_bd_address -offset 0x080000000 -range 256M -target_address_space [get_bd_addr_spaces axi_dma_1/Data_S2MM] [get_bd_addr_segs hbm_0/SAXI_02/HBM_MEM08]
assign_bd_address -offset 0x090000000 -range 256M -target_address_space [get_bd_addr_spaces axi_dma_1/Data_S2MM] [get_bd_addr_segs hbm_0/SAXI_02/HBM_MEM09]
assign_bd_address -offset 0x0A0000000 -range 256M -target_address_space [get_bd_addr_spaces axi_dma_1/Data_S2MM] [get_bd_addr_segs hbm_0/SAXI_02/HBM_MEM10]
assign_bd_address -offset 0x0B0000000 -range 256M -target_address_space [get_bd_addr_spaces axi_dma_1/Data_S2MM] [get_bd_addr_segs hbm_0/SAXI_02/HBM_MEM11]
assign_bd_address -offset 0x0C0000000 -range 256M -target_address_space [get_bd_addr_spaces axi_dma_1/Data_S2MM] [get_bd_addr_segs hbm_0/SAXI_02/HBM_MEM12]
assign_bd_address -offset 0x0D0000000 -range 256M -target_address_space [get_bd_addr_spaces axi_dma_1/Data_S2MM] [get_bd_addr_segs hbm_0/SAXI_02/HBM_MEM13]
assign_bd_address -offset 0x0E0000000 -range 256M -target_address_space [get_bd_addr_spaces axi_dma_1/Data_S2MM] [get_bd_addr_segs hbm_0/SAXI_02/HBM_MEM14]
assign_bd_address -offset 0x0F0000000 -range 256M -target_address_space [get_bd_addr_spaces axi_dma_1/Data_S2MM] [get_bd_addr_segs hbm_0/SAXI_02/HBM_MEM15]
assign_bd_address -offset 0x100000000 -range 256M -target_address_space [get_bd_addr_spaces axi_dma_1/Data_S2MM] [get_bd_addr_segs hbm_0/SAXI_02/HBM_MEM16]
assign_bd_address -offset 0x110000000 -range 256M -target_address_space [get_bd_addr_spaces axi_dma_1/Data_S2MM] [get_bd_addr_segs hbm_0/SAXI_02/HBM_MEM17]
assign_bd_address -offset 0x120000000 -range 256M -target_address_space [get_bd_addr_spaces axi_dma_1/Data_S2MM] [get_bd_addr_segs hbm_0/SAXI_02/HBM_MEM18]
assign_bd_address -offset 0x130000000 -range 256M -target_address_space [get_bd_addr_spaces axi_dma_1/Data_S2MM] [get_bd_addr_segs hbm_0/SAXI_02/HBM_MEM19]
assign_bd_address -offset 0x140000000 -range 256M -target_address_space [get_bd_addr_spaces axi_dma_1/Data_S2MM] [get_bd_addr_segs hbm_0/SAXI_02/HBM_MEM20]
assign_bd_address -offset 0x150000000 -range 256M -target_address_space [get_bd_addr_spaces axi_dma_1/Data_S2MM] [get_bd_addr_segs hbm_0/SAXI_02/HBM_MEM21]
assign_bd_address -offset 0x160000000 -range 256M -target_address_space [get_bd_addr_spaces axi_dma_1/Data_S2MM] [get_bd_addr_segs hbm_0/SAXI_02/HBM_MEM22]
assign_bd_address -offset 0x170000000 -range 256M -target_address_space [get_bd_addr_spaces axi_dma_1/Data_S2MM] [get_bd_addr_segs hbm_0/SAXI_02/HBM_MEM23]
assign_bd_address -offset 0x180000000 -range 256M -target_address_space [get_bd_addr_spaces axi_dma_1/Data_S2MM] [get_bd_addr_segs hbm_0/SAXI_02/HBM_MEM24]
assign_bd_address -offset 0x190000000 -range 256M -target_address_space [get_bd_addr_spaces axi_dma_1/Data_S2MM] [get_bd_addr_segs hbm_0/SAXI_02/HBM_MEM25]
assign_bd_address -offset 0x1A0000000 -range 256M -target_address_space [get_bd_addr_spaces axi_dma_1/Data_S2MM] [get_bd_addr_segs hbm_0/SAXI_02/HBM_MEM26]
assign_bd_address -offset 0x1B0000000 -range 256M -target_address_space [get_bd_addr_spaces axi_dma_1/Data_S2MM] [get_bd_addr_segs hbm_0/SAXI_02/HBM_MEM27]
assign_bd_address -offset 0x1C0000000 -range 256M -target_address_space [get_bd_addr_spaces axi_dma_1/Data_S2MM] [get_bd_addr_segs hbm_0/SAXI_02/HBM_MEM28]
assign_bd_address -offset 0x1D0000000 -range 256M -target_address_space [get_bd_addr_spaces axi_dma_1/Data_S2MM] [get_bd_addr_segs hbm_0/SAXI_02/HBM_MEM29]
assign_bd_address -offset 0x1E0000000 -range 256M -target_address_space [get_bd_addr_spaces axi_dma_1/Data_S2MM] [get_bd_addr_segs hbm_0/SAXI_02/HBM_MEM30]
assign_bd_address -offset 0x1F0000000 -range 256M -target_address_space [get_bd_addr_spaces axi_dma_1/Data_S2MM] [get_bd_addr_segs hbm_0/SAXI_02/HBM_MEM31]
assign_bd_address -offset 0x00000000 -range 128K -target_address_space [get_bd_addr_spaces microblaze_0/Data] [get_bd_addr_segs microblaze_0_local_memory/dlmb_bram_if_cntlr/SLMB/Mem]
assign_bd_address -offset 0x41E00000 -range 64K -target_address_space [get_bd_addr_spaces microblaze_0/Data] [get_bd_addr_segs axi_dma_0/S_AXI_LITE/Reg]
assign_bd_address -offset 0x41E10000 -range 64K -target_address_space [get_bd_addr_spaces microblaze_0/Data] [get_bd_addr_segs axi_dma_1/S_AXI_LITE/Reg]
assign_bd_address -offset 0x44A00000 -range 64K -target_address_space [get_bd_addr_spaces microblaze_0/Data] [get_bd_addr_segs axi_traffic_gen_0/S_AXI/Reg0]
assign_bd_address -offset 0x00000000 -range 128K -target_address_space [get_bd_addr_spaces microblaze_0/Instruction] [get_bd_addr_segs microblaze_0_local_memory/ilmb_bram_if_cntlr/SLMB/Mem]

validate_bd_design
save_bd_design
